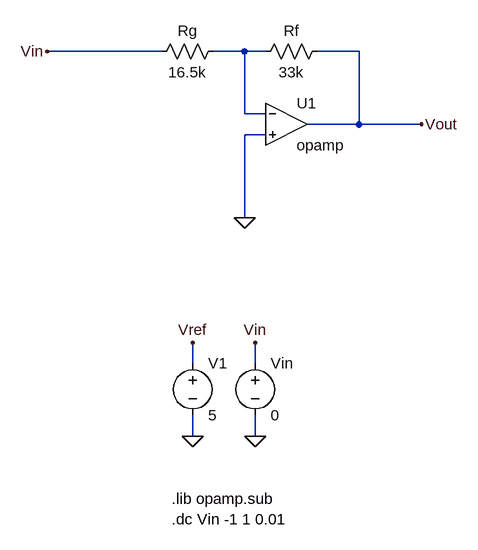
[diagram p0: schematic mnbz.asc]
mnbz.asc, the LTspice schematic file:
Version 4
SHEET 1 880 800
WIRE 16 64 -160 64
WIRE 144 64 96 64
WIRE 176 64 144 64
WIRE 320 64 256 64
WIRE 144 160 144 64
WIRE 176 160 144 160
WIRE 320 176 320 64
WIRE 320 176 240 176
WIRE 416 176 320 176
WIRE 176 192 144 192
WIRE 144 320 144 192
WIRE 64 544 64 512
WIRE 160 544 160 512
WIRE 64 656 64 624
WIRE 160 656 160 624
FLAG 64 512 Vref
FLAG 64 656 0
FLAG 160 656 0
FLAG -160 64 Vin
FLAG 416 176 Vout
FLAG 160 512 Vin
FLAG 144 320 0
SYMBOL voltage 160 528 R0
SYMATTR InstName Vin
SYMATTR Value 0
SYMBOL res 272 48 R90
WINDOW 0 0 56 VBottom 2
WINDOW 3 32 56 VTop 2
SYMATTR InstName Rf
SYMATTR Value 33k
SYMBOL res 112 48 R90
WINDOW 0 0 56 VBottom 2
WINDOW 3 32 56 VTop 2
SYMATTR InstName Rg
SYMATTR Value 16.5k
SYMBOL voltage 64 528 R0
SYMATTR InstName V1
SYMATTR Value 5
SYMBOL Opamps\\opamp 208 112 R0
SYMATTR InstName U1
TEXT 32 784 Left 2 !.dc Vin -1 1 0.01
TEXT 32 752 Left 2 !.lib opamp.sub

The netlist it stands for:
* mnbz.asc
Vin Vin 0 0
Rf Vout N001 33k
Rg N001 Vin 16.5k
V1 Vref 0 5
XU1 N001 0 Vout opamp Aol=100K GBW=10Meg  ; pins invin noninvin out
.dc Vin -1 1 0.01
.lib opamp.sub
.backanno
.end